# EAGLE design PIC18f26k40_TPLinkBackpack (EAGLE 8.2.1)
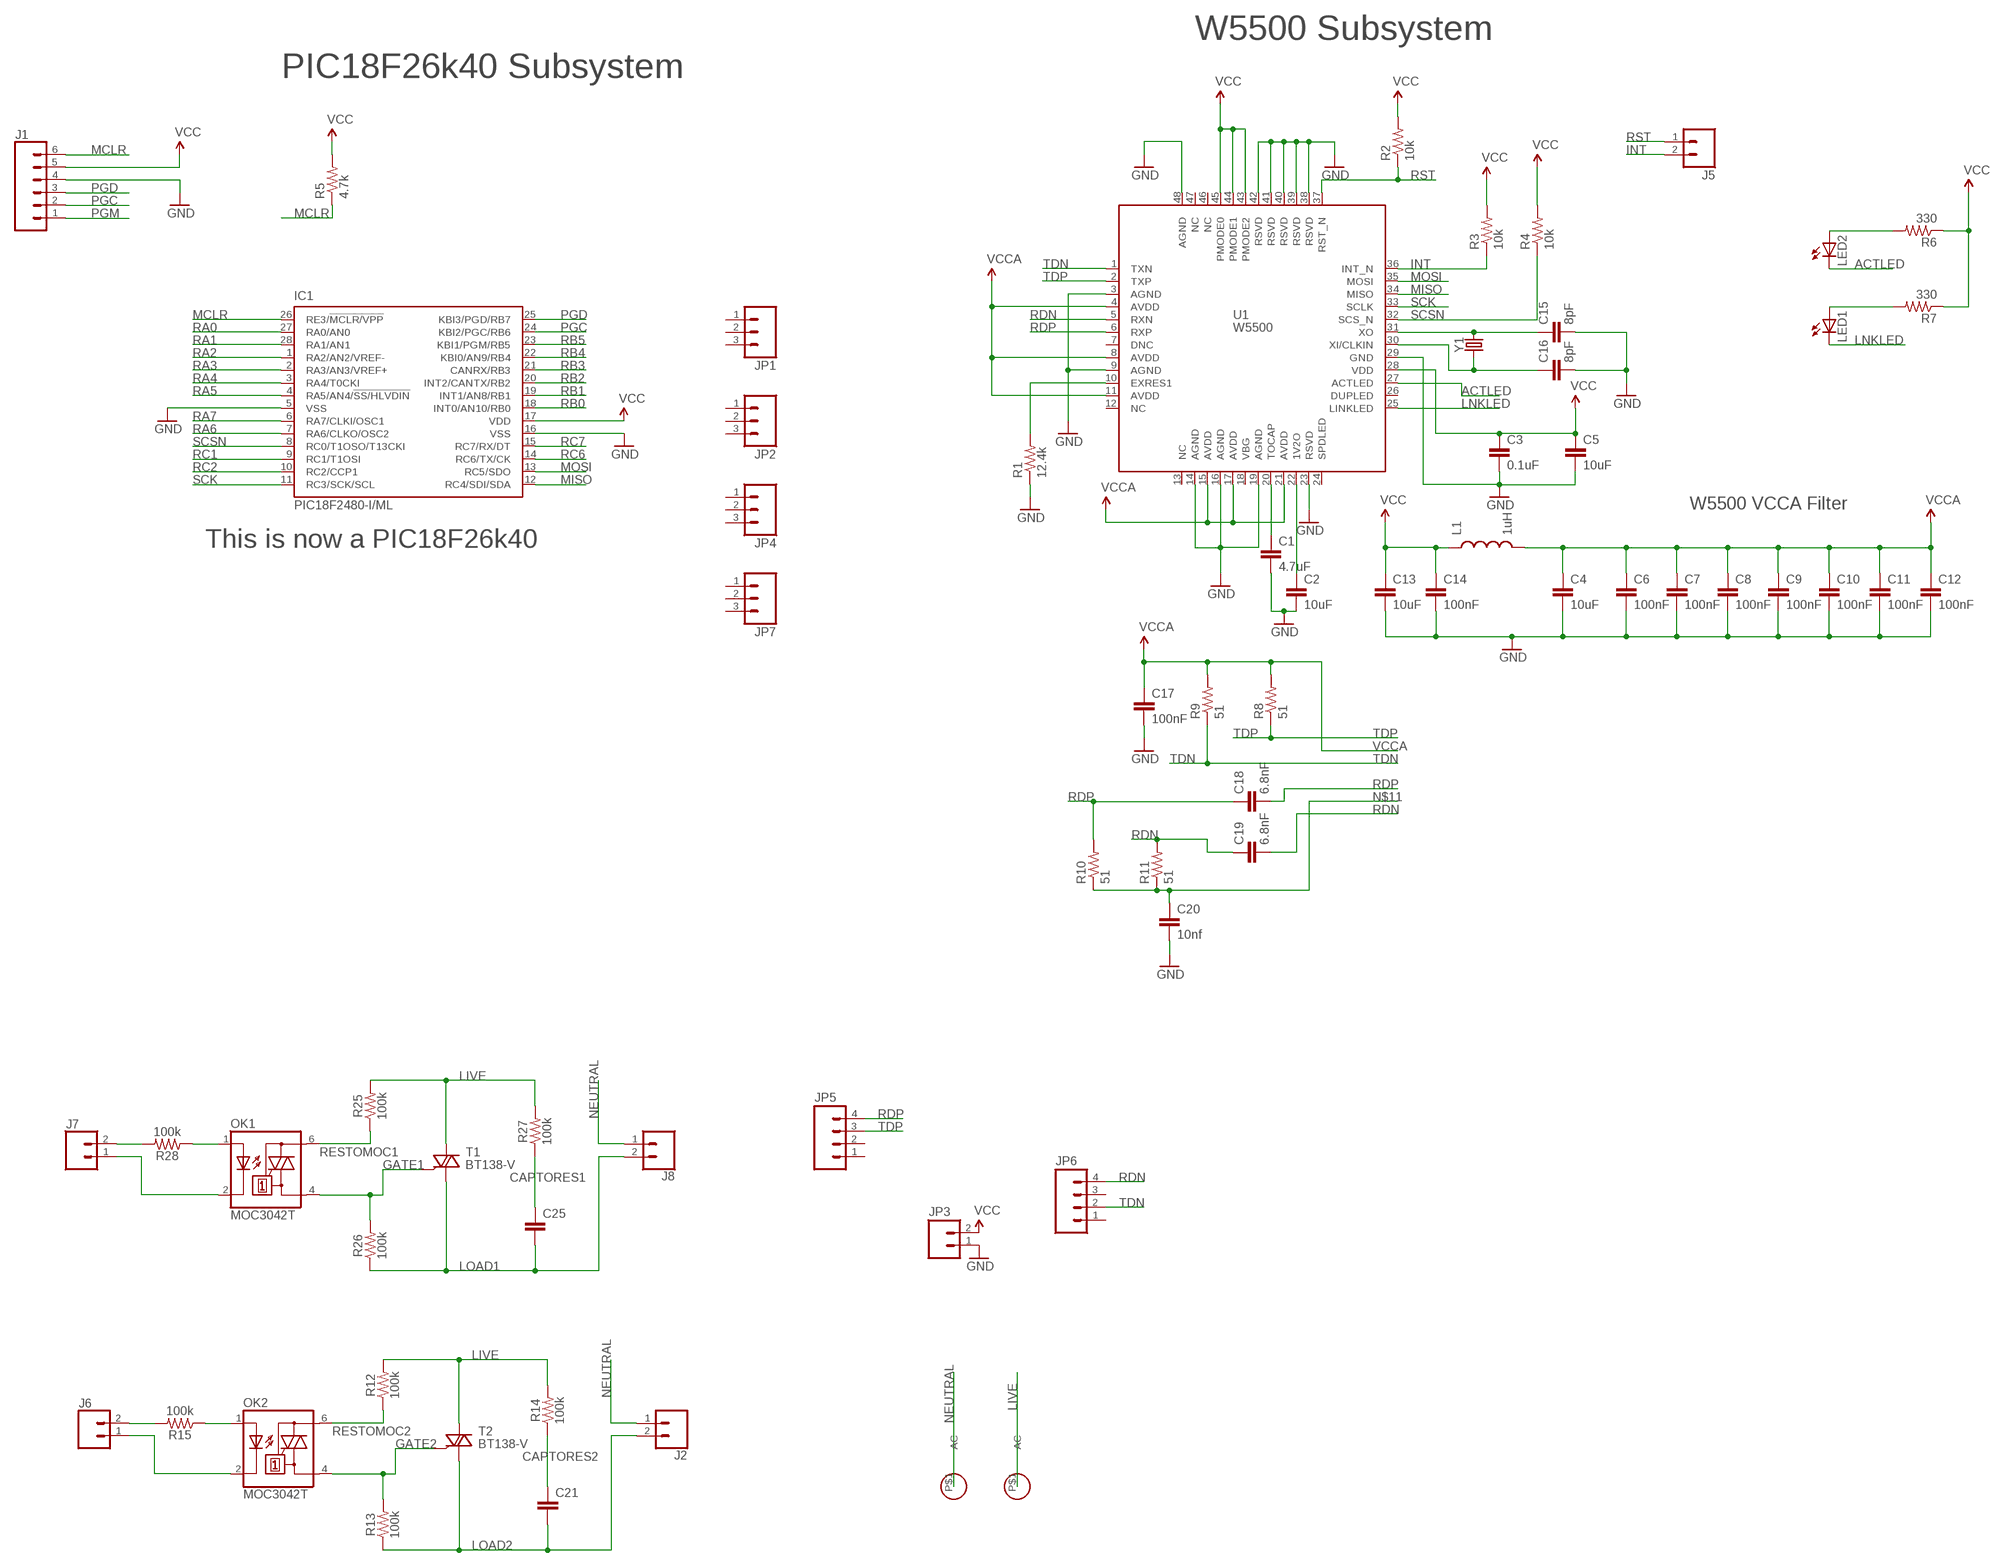
[diagram p0: schematic, sheet 1]

## Parts
AC_L  AC_BLADE  [AC_BLADE]
AC_N  AC_BLADE  [AC_BLADE]
C1  4.7uF  CAP0603-CAP  [0603-CAP]
C2  10uF  CAP0603-CAP  [0603-CAP]
C3  0.1uF  CAP0603-CAP  [0603-CAP]
C4  10uF  CAP0603-CAP  [0603-CAP]
C5  10uF  CAP0603-CAP  [0603-CAP]
C6  100nF  CAP0603-CAP  [0603-CAP]
C7  100nF  CAP0603-CAP  [0603-CAP]
C8  100nF  CAP0603-CAP  [0603-CAP]
C9  100nF  CAP0603-CAP  [0603-CAP]
C10  100nF  CAP0603-CAP  [0603-CAP]
C11  100nF  CAP0603-CAP  [0603-CAP]
C12  100nF  CAP0603-CAP  [0603-CAP]
C13  10uF  CAP0603-CAP  [0603-CAP]
C14  100nF  CAP0603-CAP  [0603-CAP]
C15  8pF  CAP0603-CAP  [0603-CAP]
C16  8pF  CAP0603-CAP  [0603-CAP]
C17  100nF  CAP0603-CAP  [0603-CAP]
C18  6.8nF  CAP0603-CAP  [0603-CAP]
C19  6.8nF  CAP0603-CAP  [0603-CAP]
C20  10nf  CAP0603-CAP  [0603-CAP]
C21  CAP0603-CAP  [0603-CAP]
C25  CAP0603-CAP  [0603-CAP]
IC1  PIC18F2480-I/ML  [QFN28-ML_6X6MM]
J1  CONN_06NO_SILK_FEMALE_PTH  [1X06_NO_SILK]
J2  CONN_025MM  [SCREWTERMINAL-5MM-2]
J5  M02PTH  [1X02@1]
J6  CONN_02  [1X02]
J7  CONN_02  [1X02]
J8  CONN_025MM  [SCREWTERMINAL-5MM-2]
JP1  M03LONGPADS  [1X03_LONGPADS]
JP2  M03LONGPADS  [1X03_LONGPADS]
JP3  M021X02_NO_SILK  [1X02_NO_SILK@1]
JP4  M03LONGPADS  [1X03_LONGPADS]
JP5  M04NO_SILK_ALL_ROUND  [1X04_NO_SILK_ALL_ROUND]
JP6  M04NO_SILK_ALL_ROUND  [1X04_NO_SILK_ALL_ROUND]
JP7  M03LONGPADS  [1X03_LONGPADS]
L1  1uH  INDUCTOR0603  [0603]
LED1  LEDCHIP-LED0805  [CHIP-LED0805]
LED2  LEDCHIP-LED0805  [CHIP-LED0805]
OK1  MOC3042T  [DIL06B]
OK2  MOC3042T  [DIL06B]
R1  12.4k  RESISTOR0603-RES  [0603-RES]
R2  10k  RESISTOR0603-RES  [0603-RES]
R3  10k  RESISTOR0603-RES  [0603-RES]
R4  10k  RESISTOR0603-RES  [0603-RES]
R5  4.7k  RESISTOR0603-RES  [0603-RES]
R6  330  RESISTOR0603-RES  [0603-RES]
R7  330  RESISTOR0603-RES  [0603-RES]
R8  51  RESISTOR0603-RES  [0603-RES]
R9  51  RESISTOR0603-RES  [0603-RES]
R10  51  RESISTOR0603-RES  [0603-RES]
R11  51  RESISTOR0603-RES  [0603-RES]
R12  100k  100KOHM-0603-1/10W-1%  [0603]
R13  100k  100KOHM-0603-1/10W-1%  [0603]
R14  100k  100KOHM-0603-1/10W-1%  [0603]
R15  100k  100KOHM-0603-1/10W-1%  [0603]
R25  100k  100KOHM-0603-1/10W-1%  [0603]
R26  100k  100KOHM-0603-1/10W-1%  [0603]
R27  100k  100KOHM-0603-1/10W-1%  [0603]
R28  100k  100KOHM-0603-1/10W-1%  [0603]
T1  BT138-V  [TO220BV]
T2  BT138-V  [TO220BV]
U1  W5500  [W5500]
Y1  CRYSTALSMD-3.2X2.5  [CRYSTAL-SMD-3.2X2.5MM]

## Nets
ACTLED: LED2.C U1.27(ACTLED)
CAPTORES1: C25.1 R27.1
CAPTORES2: C21.1 R14.1
GATE1: OK1.4(A1) R26.2 T1.G
GATE2: OK2.4(A1) R13.2 T2.G
GND: C1.2 C2.2 C3.2 C4.2 C5.2 C6.2 C7.2 C8.2 C9.2 C10.2 C11.2 C12.2 C13.2 C14.2 C15.2 C16.2 C17.2 C20.2 IC1.5(VSS) IC1.16(VSS) J1.4 JP3.1 R1.1 U1.3(AGND) U1.9(AGND) U1.14(AGND) U1.16(AGND) U1.19(AGND) U1.23(RSVD) U1.29(GND) U1.38(RSVD) U1.39(RSVD) U1.40(RSVD) U1.41(RSVD) U1.42(RSVD) U1.48(AGND)
INT: J5.2 R3.1 U1.36(INT_N)
LIVE: AC_L.P$1(AC) R12.2 R14.2 R25.2 R27.2 T1.T2(A2) T2.T2(A2)
LNKLED: LED1.C U1.25(LINKLED)
LOAD1: C25.2 J8.2 R26.1 T1.T1(A1)
LOAD2: C21.2 J2.2 R13.1 T2.T1(A1)
MCLR: IC1.26(RE3/!MCLR/VPP) J1.6 R5.1
MISO: IC1.12(RC4/SDI/SDA) U1.34(MISO)
MOSI: IC1.13(RC5/SDO) U1.35(MOSI)
N$1: C1.1 U1.20(TOCAP)
N$2: C2.1 U1.22(1V2O)
N$3: J7.2 R28.2
N$4: R1.2 U1.10(EXRES1)
N$5: C15.1 U1.31(XO) Y1.3
N$6: C16.1 U1.30(XI/CLKIN) Y1.1
N$7: LED2.A R6.2
N$8: J6.2 R15.2
N$9: LED1.A R7.2
N$10: OK2.1(A) R15.1
N$11: C20.1 R10.1 R11.1
N$12: J6.1 OK2.2(C)
N$18: OK1.1(A) R28.1
N$19: J7.1 OK1.2(C)
NEUTRAL: AC_N.P$1(AC) J2.1 J8.1
PGC: IC1.24(KBI2/PGC/RB6) J1.2
PGD: IC1.25(KBI3/PGD/RB7) J1.3
PGM: J1.1
RA0: IC1.27(RA0/AN0)
RA1: IC1.28(RA1/AN1)
RA2: IC1.1(RA2/AN2/VREF-)
RA3: IC1.2(RA3/AN3/VREF+)
RA4: IC1.3(RA4/T0CKI)
RA5: IC1.4(RA5/AN4/!SS/HLVDIN)
RA6: IC1.7(RA6/CLKO/OSC2)
RA7: IC1.6(RA7/CLKI/OSC1)
RB0: IC1.18(INT0/AN10/RB0)
RB1: IC1.19(INT1/AN8/RB1)
RB2: IC1.20(INT2/CANTX/RB2)
RB3: IC1.21(CANRX/RB3)
RB4: IC1.22(KBI0/AN9/RB4)
RB5: IC1.23(KBI1/PGM/RB5)
RC1: IC1.9(RC1/T1OSI)
RC2: IC1.10(RC2/CCP1)
RC6: IC1.14(RC6/TX/CK)
RC7: IC1.15(RC7/RX/DT)
RDN: C19.1 C19.2 JP6.4 R11.2 U1.5(RXN)
RDP: C18.1 C18.2 JP5.4 R10.2 U1.6(RXP)
RESTOMOC1: OK1.6(A2) R25.1
RESTOMOC2: OK2.6(A2) R12.1
RST: J5.1 R2.1 U1.37(RST_N)
SCK: IC1.11(RC3/SCK/SCL) U1.33(SCLK)
SCSN: IC1.8(RC0/T1OSO/T13CKI) R4.1 U1.32(SCS_N)
TDN: JP6.2 R9.1 U1.1(TXN)
TDP: JP5.3 R8.1 U1.2(TXP)
VCC: C3.1 C5.1 C13.1 C14.1 IC1.17(VDD) J1.5 JP3.2 L1.1 R2.2 R3.2 R4.2 R5.2 R6.1 R7.1 U1.28(VDD) U1.43(PMODE2) U1.44(PMODE1) U1.45(PMODE0)
VCCA: C4.1 C6.1 C7.1 C8.1 C9.1 C10.1 C11.1 C12.1 C17.1 L1.2 R8.2 R9.2 U1.4(AVDD) U1.8(AVDD) U1.11(AVDD) U1.15(AVDD) U1.17(AVDD) U1.21(AVDD)
Unconnected: JP1.1 JP1.2 JP1.3 JP2.1 JP2.2 JP2.3 JP4.1 JP4.2 JP4.3 JP5.1 JP5.2 JP6.1 JP6.3 JP7.1 JP7.2 JP7.3 U1.7(DNC) U1.12(NC) U1.13(NC) U1.18(VBG) U1.24(SPDLED) U1.26(DUPLED) U1.46(NC) U1.47(NC)

## Notes on the sheet
- W5500 Subsystem
- PIC18F26k40 Subsystem
- W5500 VCCA Filter
- This is now a PIC18F26k40

## Library data of the parts
AC_L AC_N = Heep:AC_BLADE
C1-C20 = SparkFun-Passives:CAP: Capacitor Standard 0603 ceramic capacitor, and 0.1" leaded capacitor.
C21 C25 = SparkFun-Capacitors:CAP: Capacitor Standard 0603 ceramic capacitor, and 0.1" leaded capacitor.
IC1 = microchip:PIC18F2*80: 28-Pin Enhanced Flash Microcontrollers with ECAN(TM) Technology 10-Bit A/D and nanoWatt Technology Source: http://www.microchip.com .. 39637a.pdf; MF: MICROCHIP; MPN: PIC18F2480-I/ML; OC_FARNELL: 1556179; OC_NEWARK: 71J7235
J1 = SparkFun-Connectors:CONN_06: Multi connection point. Often used as Generic Header-pin footprint for 0.1 inch spaced/style header connections On any of the 0.1 inch spaced packages, you can populate with these: Break Away Headers - Straight <https://www.sparkfun.com/products/116> (PRT-00116) Break Away Male Headers - Right Angle <https://www.sparkfun.com/products/553> (PRT-00553) Female Headers <https://www.sparkfun.com/products/115> (PRT-00115) Break Away Headers - Machine Pin <https://www.sparkfun.com/products/117> (PRT-00117) Break Away Female Headers - Swiss Machine Pin <https://www.sparkfun.com/products/743> (PRT-00743) Arduino Stackable Header - 6 Pin <https://www.sparkfun.com/products/9280> (PRT-09280) For SCREWTERMINALS and SPRING TERMINALS visit here: Screw Terimnals on SparkFun.com <https://www.sparkfun.com/search/results?term=Screw+Terminals> (5mm/3.5mm/2.54mm spacing) This device is also useful as a general connection point to wire up your design to another part of your project. Our various solder wires solder well into these plated through hole pads. Hook-Up Wire - Assortment (Stranded, 22 AWG) <https://www.sparkfun.com/products/11375> (PRT-11375) Hook-Up Wire - Assortment (Solid Core, 22 AWG) <https://www.sparkfun.com/products/11367> (PRT-11367) View the entire wire category on our website here <https://www.sparkfun.com/categories/141>; PROD_ID: CONN-08437
J2 J8 = SparkFun-Connectors:CONN_02: Multi connection point. Often used as Generic Header-pin footprint for 0.1 inch spaced/style header connections On any of the 0.1 inch spaced packages, you can populate with these: Break Away Headers - Straight <https://www.sparkfun.com/products/116> (PRT-00116) Break Away Male Headers - Right Angle <https://www.sparkfun.com/products/553> (PRT-00553) Female Headers <https://www.sparkfun.com/products/115> (PRT-00115) Break Away Headers - Machine Pin <https://www.sparkfun.com/products/117> (PRT-00117) Break Away Female Headers - Swiss Machine Pin <https://www.sparkfun.com/products/743> (PRT-00743) For SCREWTERMINALS and SPRING TERMINALS visit here: Screw Terimnals on SparkFun.com <https://www.sparkfun.com/search/results?term=Screw+Terminals> (5mm/3.5mm/2.54mm spacing) This device is also useful as a general connection point to wire up your design to another part of your project. Our various solder wires solder well into these plated through hole pads. Hook-Up Wire - Assortment (Stranded, 22 AWG) <https://www.sparkfun.com/products/11375> (PRT-11375) Hook-Up Wire - Assortment (Solid Core, 22 AWG) <https://www.sparkfun.com/products/11367> (PRT-11367) View the entire wire category on our website here <https://www.sparkfun.com/categories/141> Special notes: Molex polarized connector foot print use with: PRT-08233 with associated crimp pins and housings. 2.54_SCREWTERM for use with PRT-10571. 3.5mm Screw Terminal footprints for PRT-08084 5mm Screw Terminal footprints for use with PRT-08432; SF_SKU: PRT-08432
J5 JP3 = SparkFun-Connectors:M02: Standard 2-pin 0.1" header. Use with - straight break away headers ( PRT-00116) - right angle break away headers (PRT-00553) - swiss pins (PRT-00743) - machine pins (PRT-00117) - female headers (PRT-00115) Molex polarized connector foot print use with: PRT-08233 with associated crimp pins and housings. 2.54_SCREWTERM for use with PRT-10571. 3.5mm Screw Terminal footprints for PRT-08084 5mm Screw Terminal footprints for use with PRT-08432
J6 J7 = SparkFun-Connectors:CONN_02: Multi connection point. Often used as Generic Header-pin footprint for 0.1 inch spaced/style header connections On any of the 0.1 inch spaced packages, you can populate with these: Break Away Headers - Straight <https://www.sparkfun.com/products/116> (PRT-00116) Break Away Male Headers - Right Angle <https://www.sparkfun.com/products/553> (PRT-00553) Female Headers <https://www.sparkfun.com/products/115> (PRT-00115) Break Away Headers - Machine Pin <https://www.sparkfun.com/products/117> (PRT-00117) Break Away Female Headers - Swiss Machine Pin <https://www.sparkfun.com/products/743> (PRT-00743) For SCREWTERMINALS and SPRING TERMINALS visit here: Screw Terimnals on SparkFun.com <https://www.sparkfun.com/search/results?term=Screw+Terminals> (5mm/3.5mm/2.54mm spacing) This device is also useful as a general connection point to wire up your design to another part of your project. Our various solder wires solder well into these plated through hole pads. Hook-Up Wire - Assortment (Stranded, 22 AWG) <https://www.sparkfun.com/products/11375> (PRT-11375) Hook-Up Wire - Assortment (Solid Core, 22 AWG) <https://www.sparkfun.com/products/11367> (PRT-11367) View the entire wire category on our website here <https://www.sparkfun.com/categories/141> Special notes: Molex polarized connector foot print use with: PRT-08233 with associated crimp pins and housings. 2.54_SCREWTERM for use with PRT-10571. 3.5mm Screw Terminal footprints for PRT-08084 5mm Screw Terminal footprints for use with PRT-08432
JP1 JP2 JP4 JP7 = SparkFun-Connectors:M03: Header 3 Standard 3-pin 0.1" header. Use with straight break away headers (SKU : PRT-00116), right angle break away headers (PRT-00553), swiss pins (PRT-00743), machine pins (PRT-00117), and female headers (PRT-00115). Molex polarized connector foot print use with SKU : PRT-08232 with associated crimp pins and housings.
JP5 JP6 = SparkFun-Connectors:M04: Header 4 Standard 4-pin 0.1" header. Use with straight break away headers (SKU : PRT-00116), right angle break away headers (PRT-00553), swiss pins (PRT-00743), machine pins (PRT-00117), and female headers (PRT-00115). Molex polarized connector foot print use with SKU : PRT-08231 with associated crimp pins and housings. 1MM SMD Version SKU: PRT-10208
L1 = SparkFun-Passives:INDUCTOR: Inductors Basic Inductor/Choke - 0603 and 1206. Footprints are not proven and vary greatly between part numbers. INDUCTOR POWER 3.3UH 4.0A SMD 0.197" L x 0.197" W x 0.177" H (5.00mm x 5.00mm x 4.50mm)
LED1 LED2 = adafruit:LED: LED OSRAM: - CHIPLED LG R971, LG N971, LY N971, LG Q971, LY Q971, LO R971, LY R971 LH N974, LH R974 LS Q976, LO Q976, LY Q976 LO Q996 - Hyper CHIPLED LW Q18S LB Q993, LB Q99A, LB R99A - SideLED LS A670, LO A670, LY A670, LG A670, LP A670 LB A673, LV A673, LT A673, LW A673 LH A674 LY A675 LS A676, LA A676, LO A676, LY A676, LW A676 LS A679, LY A679, LG A679 - Hyper Micro SIDELED® LS Y876, LA Y876, LO Y876, LY Y876 LT Y87S - SmartLED LW L88C, LW L88S LB L89C, LB L89S, LG L890 LS L89K, LO L89K, LY L89K LS L896, LA L896, LO L896, LY L896 - TOPLED LS T670, LO T670, LY T670, LG T670, LP T670 LSG T670, LSP T670, LSY T670, LOP T670, LYG T670 LG T671, LOG T671, LSG T671 LB T673, LV T673, LT T673, LW T673 LH T674 LS T676, LA T676, LO T676, LY T676, LB T676, LH T676, LSB T676, LW T676 LB T67C, LV T67C, LT T67C, LS T67K, LO T67K, LY T67K, LW E67C LS E67B, LA E67B, LO E67B, LY E67B, LB E67C, LV E67C, LT E67C LW T67C LS T679, LY T679, LG T679 LS T770, LO T770, LY T770, LG T770, LP T770 LB T773, LV T773, LT T773, LW T773 LH T774 LS E675, LA E675, LY E675, LS T675 LS T776, LA T776, LO T776, LY T776, LB T776 LHGB T686 LT T68C, LB T68C - Hyper Mini TOPLED® LB M676 - Mini TOPLED Santana® LG M470 LS M47K, LO M47K, LY M47K Source: http://www.osram.convergy.de/
OK1 OK2 = optocoupler:MOC30*: 6-Pin DIP Zero-Cross Optoisolators Triac Driver Output (250/400 Volt Peak) Source: Data sheet <http://www.fairchildsemi.com/ds/MO/MOC3031M.pdf> The old path of data sheet not more available 2013-05-06.; OC_FARNELL: unknown; OC_NEWARK: unknown
R1-R11 = SparkFun-Passives:RESISTOR: Resistor Basic schematic elements and footprints for 0603, 1206, and PTH resistors.
R12-R15 R25-R28 = SparkFun-Resistors:100KOHM: 100kΩ resistor A resistor is a passive two-terminal electrical component that implements electrical resistance as a circuit element. Resistors act to reduce current flow, and, at the same time, act to lower voltage levels within circuits. - Wikipedia; PROD_ID: RES-07828
T1 T2 = triac:BT138: TRIAC Source: http://www.semiconductors.philips.com BT138_SERIES_2.pdf
U1 = W5500:W5500
Y1 = SparkFun-Clocks:CRYSTAL: Crystals (Generic) These are passive quartz crystals, which can be used as a clock source for a microcontroller. Crystal's are two-terminal devices. They require external "load" capacitors to generate an oscillating signal.

## Board
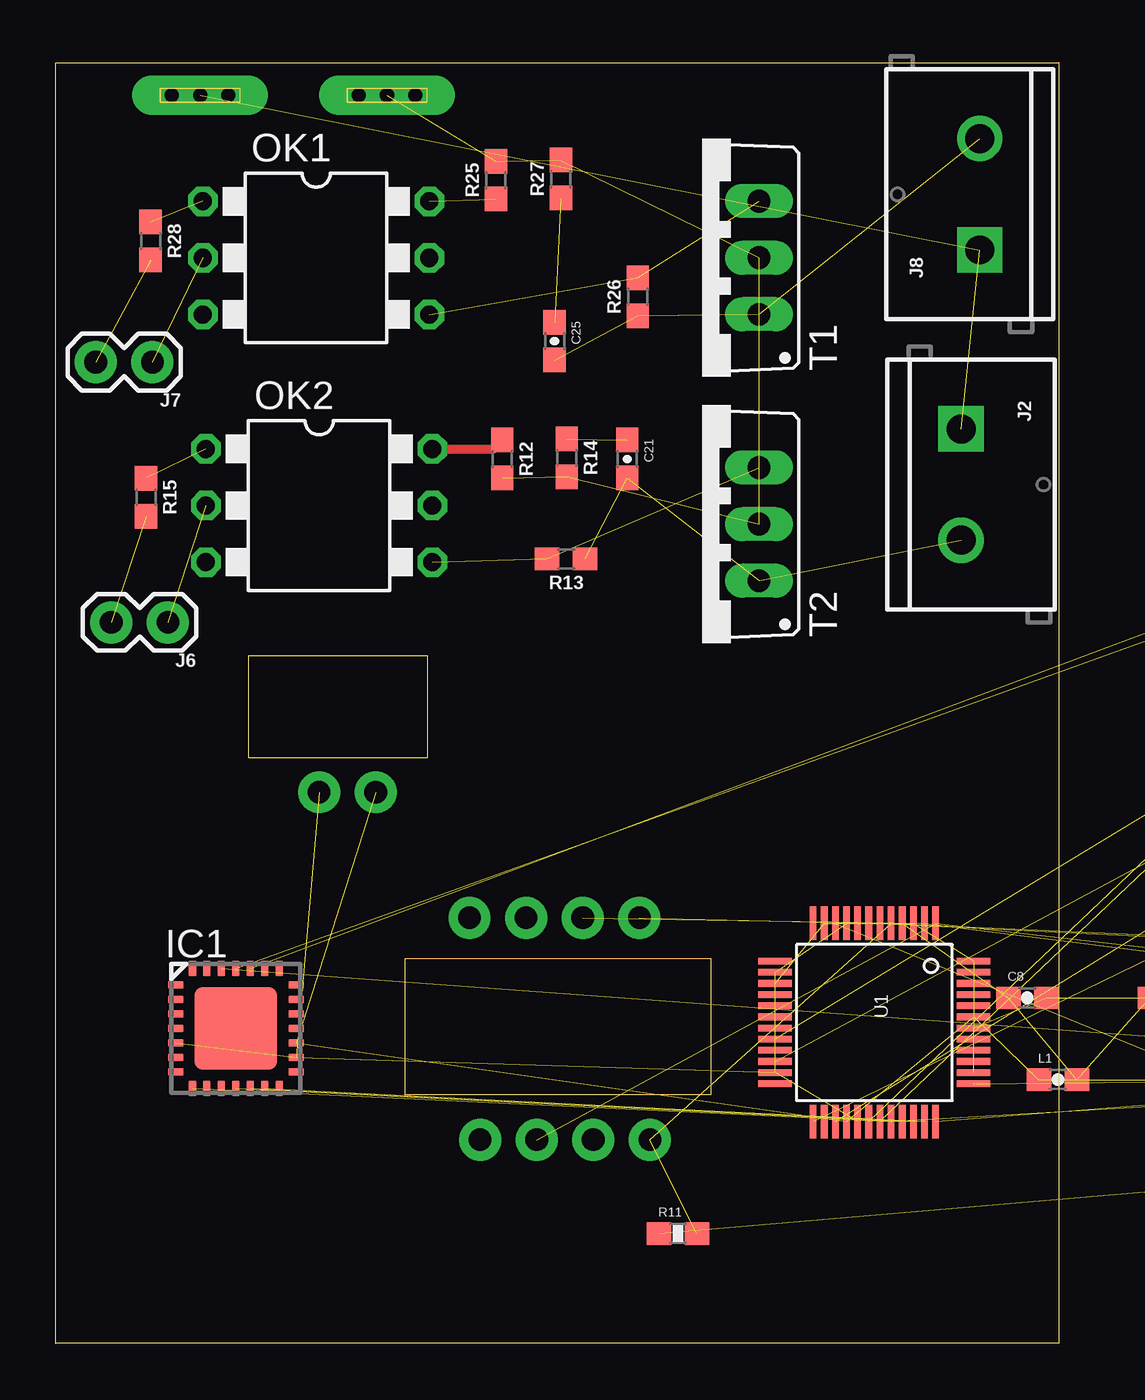
[diagram p1: board, top side]

Size 45.01 x 57.53 mm. Coordinates in mm from the lower left corner, seen from the top.
Outline: 0.01,0.03 45.01,0.03 45.01,57.53
Outline: 0,0 0,57.5 45,57.5
Outline: 29.38,11.18 15.68,11.18 15.68,17.3 29.38,17.3 29.38,11.18
Outline: 16.67,26.29 8.67,26.29 8.67,30.89 16.67,30.89 16.67,26.29
Outline: 8.26,55.72 4.7,55.72 4.7,56.35 8.26,56.35 8.26,55.72
Outline: 16.64,55.72 13.08,55.72 13.08,56.35 16.64,56.35 16.64,55.72
Copper layers (1*16): Top 0.035mm / dielectric 1.5mm / Bottom 0.035mm
Design rules "SeeedStudio_2layer_DRU_no_angle_20140221": minimum track width 6mil, minimum drill 12mil, track to track 6mil, track to pad 6mil, pad to pad 6mil, via to via 6mil, smd to smd 0mil, copper to edge 10mil, drill to drill 10mil, minimum pad ring 10mil, minimum via ring 6mil, stop-mask expansion 2mil, vias tented up to drill 100mil, thermal gap 10mil

### Footprints (pad centres in the part's own frame; a part is rotated, then mirrored left to right if it is on the bottom)
AC_BLADE = drill 0.635 pad 1.778 long: P$1 0,0; P$2 -1.27,0; P$3 1.27,0
0603-CAP = smd 1.1 x 1: 1 -0.85,0; 2 0.85,0
QFN28-ML_6X6MM = smd 0.7 x 0.35: 1 -2.7,1.95; 2 -2.7,1.3; 3 -2.7,0.65; 4 -2.7,0; 5 -2.7,-0.65; 6 -2.7,-1.3; 7 -2.7,-1.95; 15 2.7,-1.95; 16 2.7,-1.3; 17 2.7,-0.65; 18 2.7,0; 19 2.7,0.65; 20 2.7,1.3; 21 2.7,1.95 | smd 0.35 x 0.7: 8 -1.95,-2.7; 9 -1.3,-2.7; 10 -0.65,-2.7; 11 0,-2.7; 12 0.65,-2.7; 13 1.3,-2.7; 14 1.95,-2.7; 22 1.95,2.7; 23 1.3,2.7; 24 0.65,2.7; 25 0,2.7; 26 -0.65,2.7; 27 -1.3,2.7; 28 -1.95,2.7 | smd 3.7 x 3.7: EXP 0,0
1X06_NO_SILK = drill 1.016 pad 1.88: 1 0,0; 2 2.54,0; 3 5.08,0; 4 7.62,0; 5 10.16,0; 6 12.7,0
SCREWTERMINAL-5MM-2 = drill 1.3 pad 2.032 square: 1 0,0 | drill 1.3 pad 2.032: 2 5,0
1X02@1 = drill 1.016 pad 1.88: 1 0,0; 2 2.54,0
1X02 = drill 1.016 pad 1.88: 1 0,0; 2 2.54,0
1X03_LONGPADS = drill 1.118 pad 1.88 long: 1 0,0; 2 2.54,0; 3 5.08,0
1X02_NO_SILK@1 = drill 1.016 pad 1.88: 1 0,0; 2 2.54,0
1X04_NO_SILK_ALL_ROUND = drill 1.016 pad 1.88: 1 0,0; 2 2.54,0; 3 5.08,0; 4 7.62,0
0603 = smd 1.1 x 1: 1 -0.85,0; 2 0.85,0
CHIP-LED0805 = smd 1.2 x 1.2: A 0,-1.05; C 0,1.05
DIL06B = drill 0.813 octagon: 1 -2.54,-5.08; 2 0,-5.08; 3 2.54,-5.08; 4 2.54,5.08; 5 0,5.08; 6 -2.54,5.08
0603-RES = smd 1.1 x 1: 1 -0.85,0; 2 0.85,0
TO220BV = drill 1.016 long: G 2.54,-2.54; T1 -2.54,-2.54; T2 0,-2.54
W5500 = smd 1.5 x 0.3: 1 -4.45,2.75; 2 -4.45,2.25; 3 -4.45,1.75; 4 -4.45,1.25; 5 -4.45,0.75; 6 -4.45,0.25; 7 -4.45,-0.25; 8 -4.45,-0.75; 9 -4.45,-1.25; 10 -4.45,-1.75; 11 -4.45,-2.25; 12 -4.45,-2.75; 25 4.45,-2.75; 26 4.45,-2.25; 27 4.45,-1.75; 28 4.45,-1.25; 29 4.45,-0.75; 30 4.45,-0.25; 31 4.45,0.25; 32 4.45,0.75; 33 4.45,1.25; 34 4.45,1.75; 35 4.45,2.25; 36 4.45,2.75 | smd 0.3 x 1.5: 13 -2.75,-4.45; 14 -2.25,-4.45; 15 -1.75,-4.45; 16 -1.25,-4.45; 17 -0.75,-4.45; 18 -0.25,-4.45; 19 0.25,-4.45; 20 0.75,-4.45; 21 1.25,-4.45; 22 1.75,-4.45; 23 2.25,-4.45; 24 2.75,-4.45; 37 2.75,4.45; 38 2.25,4.45; 39 1.75,4.45; 40 1.25,4.45; 41 0.75,4.45; 42 0.25,4.45; 43 -0.25,4.45; 44 -0.75,4.45; 45 -1.25,4.45; 46 -1.75,4.45; 47 -2.25,4.45; 48 -2.75,4.45
CRYSTAL-SMD-3.2X2.5MM = smd 1.2 x 1.1: 1 -1.175,-0.875; 2 1.175,-0.875; 3 1.175,0.875; 4 -1.175,0.875

### Placement (x,y rotation side)
AC_L  14.86,56.04 0 top
AC_N  6.48,56.04 0 top
C1  67.82,34.71 0 top  (outside the outline)
C2  74.17,34.71 0 top  (outside the outline)
C3  80.52,34.71 0 top  (outside the outline)
C4  86.87,34.71 0 top  (outside the outline)
C5  93.22,34.71 0 top  (outside the outline)
C6  99.57,34.71 0 top  (outside the outline)
C7  105.92,34.71 0 top  (outside the outline)
C8  43.6,15.53 0 top
C9  49.95,15.53 0 top  (outside the outline)
C10  56.3,15.53 0 top  (outside the outline)
C11  62.65,15.53 0 top  (outside the outline)
C12  69,15.53 0 top  (outside the outline)
C13  75.35,15.53 0 top  (outside the outline)
C14  81.7,15.53 0 top  (outside the outline)
C15  88.05,15.53 0 top  (outside the outline)
C16  94.4,15.53 0 top  (outside the outline)
C17  100.75,15.53 0 top  (outside the outline)
C18  107.1,15.53 0 top  (outside the outline)
C19  113.45,15.53 0 top  (outside the outline)
C20  119.8,15.53 0 top  (outside the outline)
C21  25.64,39.72 270 top
C25  22.38,45 270 top
IC1  8.08,14.16 0 top
J1  84.33,46.14 0 top  (outside the outline)
J2  40.62,41.07 270 top
J5  63.02,21.93 0 top  (outside the outline)
J6  5.03,32.38 180 top
J7  4.34,44.06 180 top
J8  41.46,49.1 90 top
JP1  5.72,-9.64 0 top  (outside the outline)
JP2  5.72,-28.43 0 top  (outside the outline)
JP3  11.82,24.76 0 top
JP4  5.72,-47.23 0 top  (outside the outline)
JP5  18.57,19.12 0 top
JP6  19.04,9.16 0 top
JP7  5.72,-66.02 0 top  (outside the outline)
L1  44.96,11.85 0 top
LED1  71.38,27.08 0 top  (outside the outline)
LED2  64.75,27.24 0 top  (outside the outline)
OK1  11.69,48.74 270 top
OK2  11.82,37.63 270 top
R1  51.31,11.85 0 top  (outside the outline)
R2  57.66,11.85 0 top  (outside the outline)
R3  64.01,11.85 0 top  (outside the outline)
R4  70.36,11.85 0 top  (outside the outline)
R5  76.71,11.85 0 top  (outside the outline)
R6  72.82,21.44 0 top  (outside the outline)
R7  77.19,24.67 0 top  (outside the outline)
R8  95.76,11.85 0 top  (outside the outline)
R9  102.11,11.85 0 top  (outside the outline)
R10  108.46,11.85 0 top  (outside the outline)
R11  27.92,4.95 0 top
R12  20.04,39.72 270 top
R13  22.9,35.24 180 top
R14  22.93,39.77 270 top
R15  4.05,38 270 top
R25  19.75,52.23 90 top
R26  26.12,47 90 top
R27  22.67,52.28 90 top
R28  4.26,49.5 270 top
T1  29.02,48.75 90 top
T2  29.02,36.79 90 top
U1  36.73,14.43 270 top
Y1  61.47,33.44 0 top  (outside the outline)

### Tracks (layer width: path | path; a pad name or v marks a point on that pad's centre or on a via)
ACTLED  (1 unrouted)
CAPTORES1  (1 unrouted)
CAPTORES2  (1 unrouted)
GATE1  (2 unrouted)
GATE2  (2 unrouted)
GND  (35 unrouted)
INT  (2 unrouted)
LIVE  (6 unrouted)
LNKLED  (1 unrouted)
LOAD1  (3 unrouted)
LOAD2  (3 unrouted)
MCLR  (2 unrouted)
MISO  (1 unrouted)
MOSI  (1 unrouted)
N$1  (1 unrouted)
N$2  (1 unrouted)
N$3  (1 unrouted)
N$4  (1 unrouted)
N$5  (2 unrouted)
N$6  (2 unrouted)
N$7  (1 unrouted)
N$8  (1 unrouted)
N$9  (1 unrouted)
N$10  (1 unrouted)
N$11  (2 unrouted)
N$12  (1 unrouted)
N$18  (1 unrouted)
N$19  (1 unrouted)
NEUTRAL  (2 unrouted)
PGC  (1 unrouted)
PGD  (1 unrouted)
RDN  (4 unrouted)
RDP  (4 unrouted)
RESTOMOC1  (1 unrouted)
RESTOMOC2
  Top 0.406: OK2.6 19.64,40.17 R12.1
RST  (2 unrouted)
SCK  (1 unrouted)
SCSN  (2 unrouted)
TDN  (2 unrouted)
TDP  (2 unrouted)
VCC  (17 unrouted)
VCCA  (17 unrouted)